# EAGLE design Motorboard (EAGLE 7.7.0)
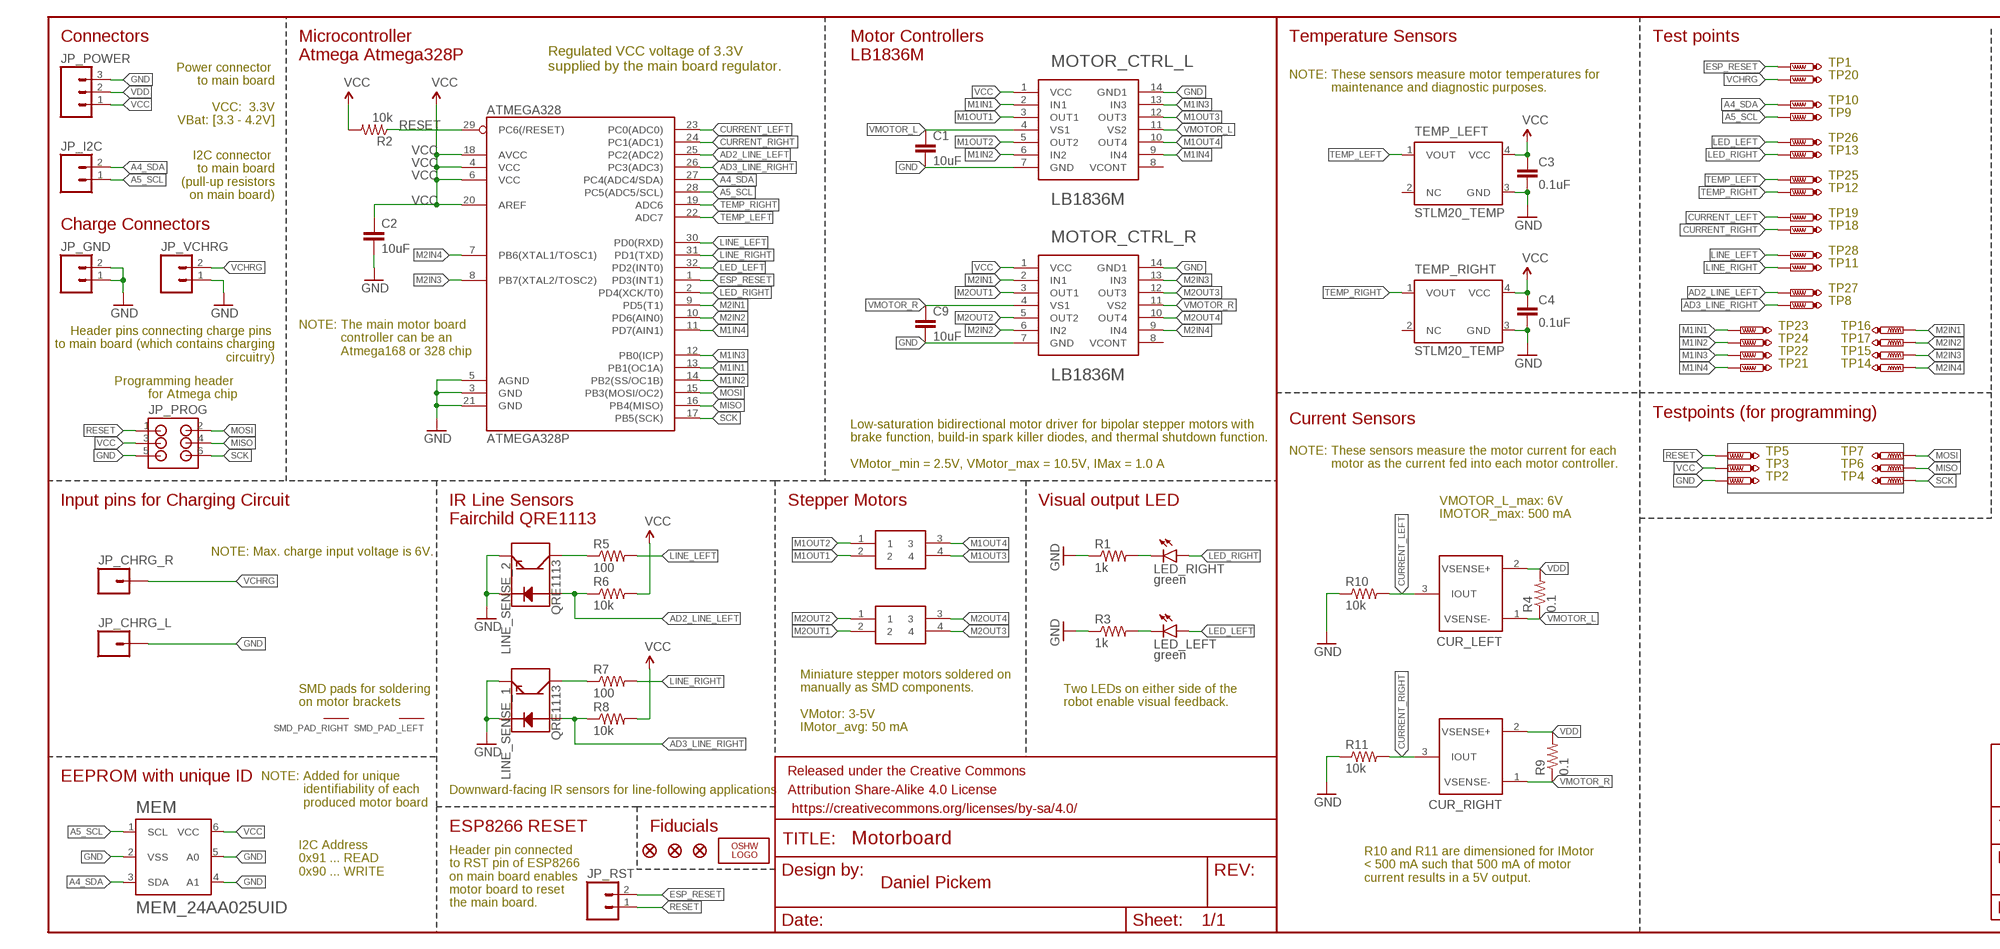
[diagram p0: schematic, sheet 1, part 1 of 2]
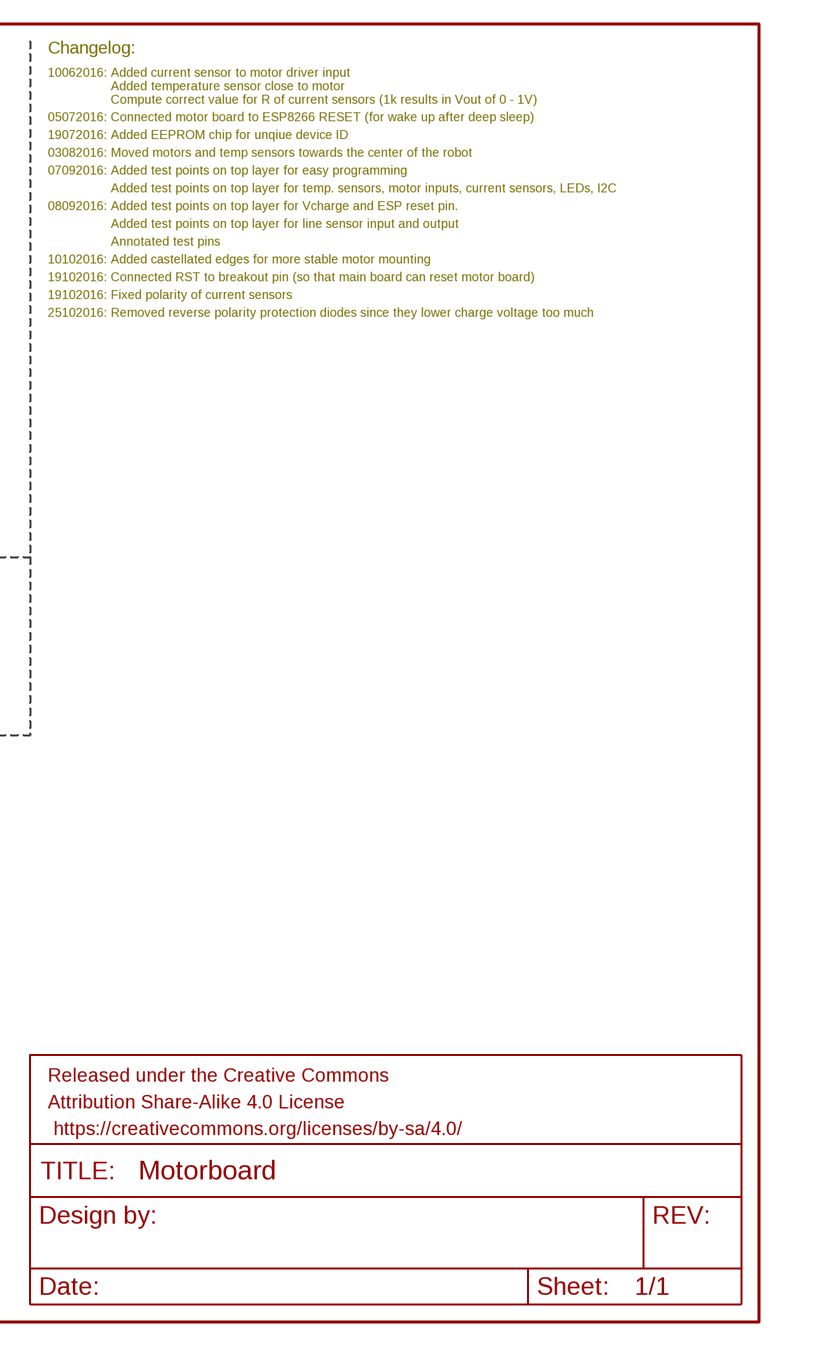
[diagram p1: schematic, sheet 1, part 2 of 2]

## Parts
ATMEGA328P  ATMEGA328  ATMEGA168  [TQFP32-08]
C1  10uF  2.2UF-25V-+80/-20(0805)  [0805]
C2  10uF  2.2UF-25V-+80/-20(0805)  [0805]
C3  0.1uF  4.7UF-6.3V-10%(0603)0603  [0603-CAP]
C4  0.1uF  4.7UF-6.3V-10%(0603)0603  [0603-CAP]
C9  10uF  2.2UF-25V-+80/-20(0805)  [0805]
CUR_LEFT  ZXCT1009_CURRENT  [SOT23-3]
CUR_RIGHT  ZXCT1009_CURRENT  [SOT23-3]
FRAME1  FRAME-LETTER  [CREATIVE_COMMONS]
FRAME2  FRAME-LETTER  [CREATIVE_COMMONS]
JP3  FIDUCIAL1X2.5  [FIDUCIAL-1X2.5]
JP4  FIDUCIAL1X2.5  [FIDUCIAL-1X2.5]
JP5  FIDUCIAL1X2.5  [FIDUCIAL-1X2.5]
JP_CHRG_L  M01NOSILK-KIT  [1X01NS-KIT]
JP_CHRG_R  M01NOSILK-KIT  [1X01NS-KIT]
JP_GND  M021X02_NO_SILK  [1X02_NO_SILK]
JP_I2C  M02PTH  [1X02]
JP_POWER  supply  M03PTH  [1X03]
JP_PROG  3X2_SMD_HEADER  [3X2_SMD_HEADER]
JP_RST  M021X02_NO_SILK  [1X02_NO_SILK]
JP_VCHRG  M021X02_NO_SILK  [1X02_NO_SILK]
LED_LEFT  green  LED0603  [LED-0603]
LED_RIGHT  green  LED0603  [LED-0603]
LINE_SENSE_1  QRE1113  [QRE1113]
LINE_SENSE_2  QRE1113  [QRE1113]
LOGO1  OSHW_LOGO_FILLX0100-NT  [OSHW_FILLX100_NOTEXT]
M1  STEPPER_MOTOR_SMD  [STEPPER_MOTOR_SMD]
M2  STEPPER_MOTOR_SMD  [STEPPER_MOTOR_SMD]
MEM  MEM_24AA025UID  [SOT23-6-MCP1640]
MOTOR_CTRL_L  LB1836M  [LSOP-14]
MOTOR_CTRL_R  LB1836M  [LSOP-14]
R1  1k  1.5KOHM1/10W1%(0603)  [0603]
R2  10k  1.5KOHM1/10W1%(0603)  [0603]
R3  1k  1.5KOHM1/10W1%(0603)  [0603]
R4  0.1  RESISTOR1206  [1206]
R5  100  1.5KOHM1/10W1%(0603)  [0603]
R6  10k  1.5KOHM1/10W1%(0603)  [0603]
R7  100  1.5KOHM1/10W1%(0603)  [0603]
R8  10k  1.5KOHM1/10W1%(0603)  [0603]
R9  0.1  RESISTOR1206  [1206]
R10  10k  1.5KOHM1/10W1%(0603)  [0603]
R11  10k  1.5KOHM1/10W1%(0603)  [0603]
SMD_PAD_LEFT  PIN_SMD2.5X1.0  [PIN_SMD_2.5X1.0]
SMD_PAD_RIGHT  PIN_SMD2.5X1.0  [PIN_SMD_2.5X1.0]
TEMP_LEFT  STLM20_TEMP  [UDFN4]
TEMP_RIGHT  STLM20_TEMP  [UDFN4]
TP1  PTR1B1,27  [B1,27]
TP2  PTR1B1,27  [B1,27]
TP3  PTR1B1,27  [B1,27]
TP4  PTR1B1,27  [B1,27]
TP5  PTR1B1,27  [B1,27]
TP6  PTR1B1,27  [B1,27]
TP7  PTR1B1,27  [B1,27]
TP8  PTR1B1,27  [B1,27]
TP9  PTR1B1,27  [B1,27]
TP10  PTR1B1,27  [B1,27]
TP11  PTR1B1,27  [B1,27]
TP12  PTR1B1,27  [B1,27]
TP13  PTR1B1,27  [B1,27]
TP14  PTR1B1,27  [B1,27]
TP15  PTR1B1,27  [B1,27]
TP16  PTR1B1,27  [B1,27]
TP17  PTR1B1,27  [B1,27]
TP18  PTR1B1,27  [B1,27]
TP19  PTR1B1,27  [B1,27]
TP20  PTR1B1,27  [B1,27]
TP21  PTR1B1,27  [B1,27]
TP22  PTR1B1,27  [B1,27]
TP23  PTR1B1,27  [B1,27]
TP24  PTR1B1,27  [B1,27]
TP25  PTR1B1,27  [B1,27]
TP26  PTR1B1,27  [B1,27]
TP27  PTR1B1,27  [B1,27]
TP28  PTR1B1,27  [B1,27]

## Nets
A4_SDA: ATMEGA328P.27(PC4(ADC4/SDA)) JP_I2C.2 MEM.3(SDA) TP10.TP
A5_SCL: ATMEGA328P.28(PC5(ADC5/SCL)) JP_I2C.1 MEM.1(SCL) TP9.TP
AD2_LINE_LEFT: ATMEGA328P.25(PC2(ADC2)) LINE_SENSE_2.1(A) R6.1 TP27.TP
AD3_LINE_RIGHT: ATMEGA328P.26(PC3(ADC3)) LINE_SENSE_1.1(A) R8.1 TP8.TP
CURRENT_LEFT: ATMEGA328P.23(PC0(ADC0)) CUR_LEFT.3(IOUT) R10.2 TP19.TP
CURRENT_RIGHT: ATMEGA328P.24(PC1(ADC1)) CUR_RIGHT.3(IOUT) R11.2 TP18.TP
ESP_RESET: ATMEGA328P.1(PD3(INT1)) JP_RST.2 TP1.TP
GND: ATMEGA328P.3(GND) ATMEGA328P.5(AGND) ATMEGA328P.21(GND) C1.2 C2.2 C3.2 C4.1 C9.2 JP_CHRG_L.1 JP_GND.1 JP_GND.2 JP_POWER.3 JP_PROG.5 JP_VCHRG.1 LINE_SENSE_1.2(K) LINE_SENSE_1.4(E) LINE_SENSE_2.2(K) LINE_SENSE_2.4(E) MEM.2(VSS) MEM.4(A1) MEM.5(A0) MOTOR_CTRL_L.7(GND) MOTOR_CTRL_L.14(GND1) MOTOR_CTRL_R.7(GND) MOTOR_CTRL_R.14(GND1) R1.1 R3.1 R10.1 R11.1 TEMP_LEFT.3(GND) TEMP_RIGHT.3(GND) TP2.TP
LED_LEFT: ATMEGA328P.32(PD2(INT0)) LED_LEFT.A TP26.TP
LED_RIGHT: ATMEGA328P.2(PD4(XCK/T0)) LED_RIGHT.A TP13.TP
LINE_LEFT: ATMEGA328P.30(PD0(RXD)) R5.2 TP28.TP
LINE_RIGHT: ATMEGA328P.31(PD1(TXD)) R7.2 TP11.TP
M1IN1: ATMEGA328P.13(PB1(OC1A)) MOTOR_CTRL_L.2(IN1) TP23.TP
M1IN2: ATMEGA328P.14(PB2(SS/OC1B)) MOTOR_CTRL_L.6(IN2) TP24.TP
M1IN3: ATMEGA328P.12(PB0(ICP)) MOTOR_CTRL_L.13(IN3) TP22.TP
M1IN4: ATMEGA328P.11(PD7(AIN1)) MOTOR_CTRL_L.9(IN4) TP21.TP
M1OUT1: M1.2 MOTOR_CTRL_L.3(OUT1)
M1OUT2: M1.1 MOTOR_CTRL_L.5(OUT2)
M1OUT3: M1.4 MOTOR_CTRL_L.12(OUT3)
M1OUT4: M1.3 MOTOR_CTRL_L.10(OUT4)
M2IN1: ATMEGA328P.9(PD5(T1)) MOTOR_CTRL_R.2(IN1) TP16.TP
M2IN2: ATMEGA328P.10(PD6(AIN0)) MOTOR_CTRL_R.6(IN2) TP17.TP
M2IN3: ATMEGA328P.8(PB7(XTAL2/TOSC2)) MOTOR_CTRL_R.13(IN3) TP15.TP
M2IN4: ATMEGA328P.7(PB6(XTAL1/TOSC1)) MOTOR_CTRL_R.9(IN4) TP14.TP
M2OUT1: M2.2 MOTOR_CTRL_R.3(OUT1)
M2OUT2: M2.1 MOTOR_CTRL_R.5(OUT2)
M2OUT3: M2.4 MOTOR_CTRL_R.12(OUT3)
M2OUT4: M2.3 MOTOR_CTRL_R.10(OUT4)
MISO: ATMEGA328P.16(PB4(MISO)) JP_PROG.4 TP6.TP
MOSI: ATMEGA328P.15(PB3(MOSI/OC2)) JP_PROG.2 TP7.TP
N$1: LED_LEFT.C R3.2
N$2: LINE_SENSE_2.3(C) R5.1
N$3: LINE_SENSE_1.3(C) R7.1
N$4: LED_RIGHT.C R1.2
RESET: ATMEGA328P.29(PC6(/RESET)) JP_PROG.1 JP_RST.1 R2.1 TP5.TP
SCK: ATMEGA328P.17(PB5(SCK)) JP_PROG.6 TP4.TP
TEMP_LEFT: ATMEGA328P.22(ADC7) TEMP_LEFT.1(VOUT) TP25.TP
TEMP_RIGHT: ATMEGA328P.19(ADC6) TEMP_RIGHT.1(VOUT) TP12.TP
VCC: ATMEGA328P.4(VCC) ATMEGA328P.6(VCC) ATMEGA328P.18(AVCC) ATMEGA328P.20(AREF) C2.1 C3.1 C4.2 JP_POWER.1 JP_PROG.3 MEM.6(VCC) MOTOR_CTRL_L.1(VCC) MOTOR_CTRL_R.1(VCC) R2.2 R6.2 R8.2 TEMP_LEFT.4(VCC) TEMP_RIGHT.4(VCC) TP3.TP
VCHRG: JP_CHRG_R.1 JP_VCHRG.2 TP20.TP
VDD: CUR_LEFT.2(VSENSE+) CUR_RIGHT.2(VSENSE+) JP_POWER.2 R4.2 R9.2
VMOTOR_L: C1.1 CUR_LEFT.1(VSENSE-) MOTOR_CTRL_L.4(VS1) MOTOR_CTRL_L.11(VS2) R4.1
VMOTOR_R: C9.1 CUR_RIGHT.1(VSENSE-) MOTOR_CTRL_R.4(VS1) MOTOR_CTRL_R.11(VS2) R9.1
Unconnected: MOTOR_CTRL_L.8(VCONT) MOTOR_CTRL_R.8(VCONT) SMD_PAD_LEFT.P$1 SMD_PAD_RIGHT.P$1 TEMP_LEFT.2(NC) TEMP_RIGHT.2(NC)

## Notes on the sheet
- Changelog:
- Connectors | Temperature Sensors | Test points
- 10062016: Added current sensor to motor driver input
                    Added temperature sensor close to motor
                    Compute correct value for R of current sensors (1k results in Vout of 0 - 1V)
- Microcontroller 
  Atmega Atmega328P
- Motor Controllers
  LB1836M
- Power connector 
  to main board
  
  VCC:  3.3V
  VBat: [3.3 - 4.2V]
- TP1
- Regulated VCC voltage of 3.3V 
  supplied by the main board regulator.
- TP20 | 05072016: Connected motor board to ESP8266 RESET (for wake up after deep sleep)
- NOTE: These sensors measure motor temperatures for 
              maintenance and diagnostic purposes.
- 19072016: Added EEPROM chip for unqiue device ID
- TP10 | 03082016: Moved motors and temp sensors towards the center of the robot
- TP9 | 07092016: Added test points on top layer for easy programming
- Added test points on top layer for temp. sensors, motor inputs, current sensors, LEDs, I2C
- TP26 | 08092016: Added test points on top layer for Vcharge and ESP reset pin.
- I2C connector 
  to main board
  (pull-up resistors
  on main board)
- TP13 | Added test points on top layer for line sensor input and output
- Annotated test pins
- TP25 | 10102016: Added castellated edges for more stable motor mounting
- TP12 | 19102016: Connected RST to breakout pin (so that main board can reset motor board)
- 19102016: Fixed polarity of current sensors
- TP19 | 25102016: Removed reverse polarity protection diodes since they lower charge voltage too much
- Charge Connectors | TP18
- TP28
- TP11
- TP27
- TP8
- Header pins connecting charge pins 
  to main board (which contains charging
  circuitry)
- TP23 | TP16
- TP24 | TP17
- NOTE: The main motor board
              controller can be an 
              Atmega168 or 328 chip
- TP22 | TP15
- TP21 | TP14
- Programming header 
  for Atmega chip
- Testpoints (for programming)
- Current Sensors
- TP5 | TP7
- Low-saturation bidirectional motor driver for bipolar stepper motors with
  brake function, build-in spark killer diodes, and thermal shutdown function.
  
  VMotor_min = 2.5V, VMotor_max = 10.5V, IMax = 1.0 A
- NOTE: These sensors measure the motor current for each
              motor as the current fed into each motor controller.
- TP3 | TP6
- TP2 | TP4
- Input pins for Charging Circuit | Stepper Motors | Visual output LED
- VMOTOR_L_max: 6V
  IMOTOR_max: 500 mA
- IR Line Sensors 
  Fairchild QRE1113
- NOTE: Max. charge input voltage is 6V.
- SMD pads for soldering
  on motor brackets
- Two LEDs on either side of the 
  robot enable visual feedback.
- Miniature stepper motors soldered on
  manually as SMD components.
  
  VMotor: 3-5V
  IMotor_avg: 50 mA
- EEPROM with unique ID
- Downward-facing IR sensors for line-following applications
- NOTE: Added for unique
              identifiability of each
              produced motor board
- ESP8266 RESET | Fiducials
- I2C Address
  0x91 ... READ
  0x90 ... WRITE
- R10 and R11 are dimensioned for IMotor 
  < 500 mA such that 500 mA of motor 
  current results in a 5V output.
- Daniel Pickem
- Header pin connected
  to RST pin of ESP8266
  on main board enables
  motor board to reset
  the main board.

## Library data of the parts
ATMEGA328P = GRITSBot:ATMEGA168: Atmel 32-pin 8-bit micro, 16k flash.
C1 C2 C9 = SparkFun-Capacitors:2.2UF-25V-+80/-20(0805): CAP-11624; PROD_ID: CAP-11624; VALUE: 2.2uF
C3 C4 = SparkFun-Capacitors:4.7UF-6.3V-10%(0603): CAP-08280; PROD_ID: CAP-08280; VALUE: 4.7uF
CUR_LEFT CUR_RIGHT = GRITSBot:ZXCT1009_CURRENT
FRAME1 FRAME2 = GRITSBot:FRAME-LETTER: Schematic Frame Standard 8.5x11 US Letter frame
JP3-JP5 = abes:FIDUCIAL: Fiducial Alignment Points Various fiducial points for machine vision alignment.
JP_CHRG_L JP_CHRG_R = SparkFun-Connectors:M01: Header 1 Standard 1-pin 0.1" header. Use with straight break away headers (SKU : PRT-00116), right angle break away headers (PRT-00553), swiss pins (PRT-00743), machine pins (PRT-00117), and female headers (PRT-00115). SMTSO-256-ET is a "flush mount" nut for a 4-40 screw. The older package used to be too tight, and did not allow it to sit properly thru the drill hit. The latest (0.165DIA) fits nice and snug.
JP_GND JP_I2C JP_RST JP_VCHRG = SparkFun-Connectors:M02: Standard 2-pin 0.1" header. Use with - straight break away headers ( PRT-00116) - right angle break away headers (PRT-00553) - swiss pins (PRT-00743) - machine pins (PRT-00117) - female headers (PRT-00115) Molex polarized connector foot print use with: PRT-08233 with associated crimp pins and housings. 2.54_SCREWTERM for use with PRT-10571. 3.5mm Screw Terminal footprints for PRT-08084 5mm Screw Terminal footprints for use with PRT-08433
JP_POWER = SparkFun-Connectors:M03: Header 3 Standard 3-pin 0.1" header. Use with straight break away headers (SKU : PRT-00116), right angle break away headers (PRT-00553), swiss pins (PRT-00743), machine pins (PRT-00117), and female headers (PRT-00115). Molex polarized connector foot print use with SKU : PRT-08232 with associated crimp pins and housings.
JP_PROG = GRITSBot:3X2_SMD_HEADER
LED_LEFT LED_RIGHT = SparkFun-LED:LED: LEDs Standard schematic elements and footprints for 5mm, 3mm, 1206, and 0603 sized LEDs. 5mm - Spark Fun Electronics SKU : COM-00529 (and others)
LINE_SENSE_1 LINE_SENSE_2 = SparkFun-Sensors:QRE1113: Reflective object sensor; PROD_ID: IC-09357
LOGO1 = OSHW:OSHW_LOGO_FILL
M1 M2 = GRITSBot:STEPPER_MOTOR_SMD
MEM = GRITSBot:MEM_24AA025UID
MOTOR_CTRL_L MOTOR_CTRL_R = GRITSBot:LB1836M: LB1836M: Low-Saturation Bidirectional Motor Driver for Low-Voltage Drive • Low voltage operation (2.5V min) • Low saturation voltage (upper transistor + lower transistor residual voltage ; 0.40V typ at 400mA). • Parallel connection (Upper transistor + lower tr ansistor residual voltage ; 0.5V typ at 800mA). • Separate logic power supply and motor power supply • Brake function • Spark killer diodes built in • Thermal shutdown circuit built in • Compact package (14-pin MFP) (see http://www.onsemi.com/pub_link/Collateral/LB1836M-D.PDF)
R1-R3 R5-R8 R10 R11 = SparkFun-Resistors:1.5KOHM1/10W1%(0603): RES-08306; PROD_ID: RES-08306; VALUE: 1.5KOHM
R4 R9 = SparkFun-Resistors:RESISTOR: Resistor Basic schematic elements and footprints for 0603, 1206, and PTH resistors.
SMD_PAD_LEFT SMD_PAD_RIGHT = GRITSBot:PIN_SMD
TEMP_LEFT TEMP_RIGHT = GRITSBot:STLM20_TEMP
TP1-TP28 = testpad:PTR1: TEST PIN

## Net classes
1 power: width 0.381 mm, clearance 0.254 mm

## Board
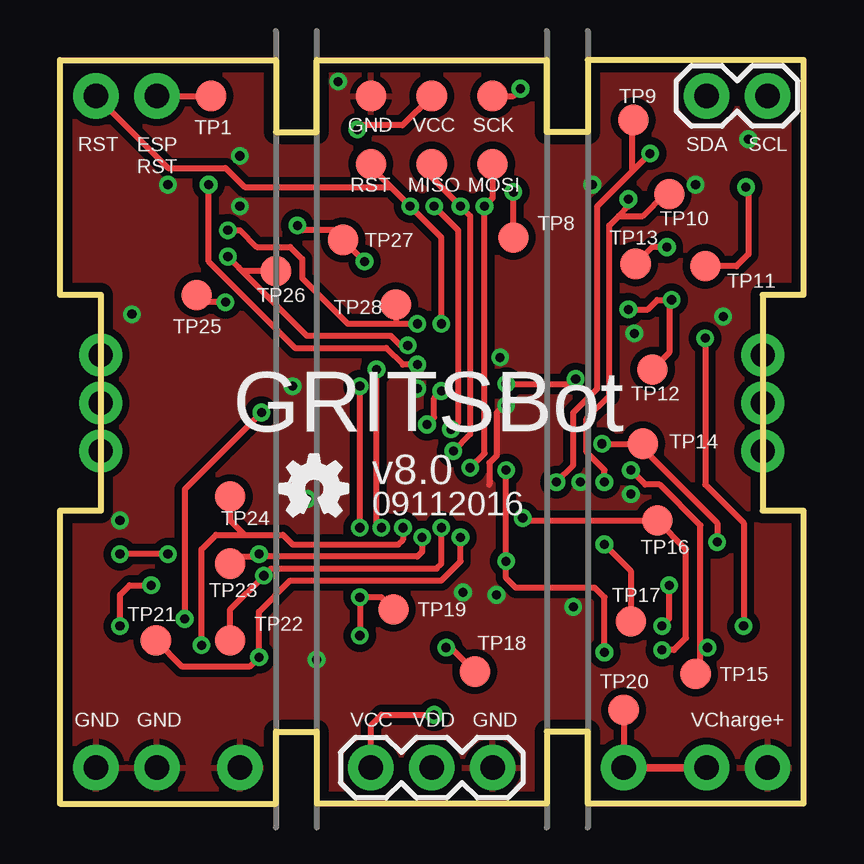
[diagram p2: board, top side]
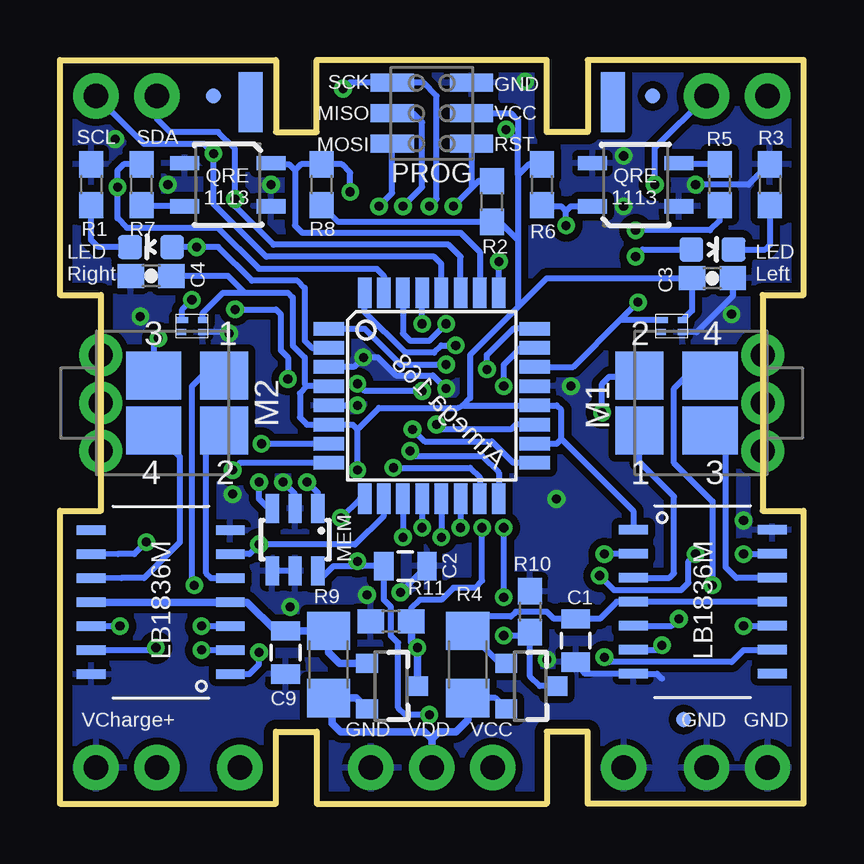
[diagram p3: board, bottom side, seen from below]

Size 31 x 31 mm. Coordinates in mm from the lower left corner, seen from the top.
Outline: 0,0 0,12.2 1.7,12.2 1.7,21.2 0,21.2 0,31 9,31 9,28 10.7,28 10.7,31 20.3,31 20.3,28 22,28 22,31 31,31 31,21.2 29.3,21.2 29.3,12.2 31,12.2 31,0 22,0 22,3 20.3,3 20.3,0 10.7,0 10.7,3 9,3 9,0 0,0
Copper layers (1*16): Top 0.0356mm / dielectric 1.5011mm / Bottom 0.0356mm
Design rules "default": minimum track width 6mil, minimum drill 13mil, track to track 6mil, track to pad 6mil, pad to pad 6mil, via to via 6mil, smd to smd 6mil, copper to edge 15mil, drill to drill 6mil, minimum pad ring 7mil, minimum via ring 7mil, stop-mask expansion 3mil, vias tented up to drill 40mil, thermal gap 10mil

### Footprints (pad centres in the part's own frame; a part is rotated, then mirrored left to right if it is on the bottom)
TQFP32-08 = smd 1.27 x 0.559: 1 -4.293,2.8; 2 -4.293,2; 3 -4.293,1.2; 4 -4.293,0.4; 5 -4.293,-0.4; 6 -4.293,-1.2; 7 -4.293,-2; 8 -4.293,-2.8; 17 4.293,-2.8; 18 4.293,-2; 19 4.293,-1.2; 20 4.293,-0.4; 21 4.293,0.4; 22 4.293,1.2; 23 4.293,2; 24 4.293,2.8 | smd 0.559 x 1.27: 9 -2.8,-4.293; 10 -2,-4.293; 11 -1.2,-4.293; 12 -0.4,-4.293; 13 0.4,-4.293; 14 1.2,-4.293; 15 2,-4.293; 16 2.8,-4.293; 25 2.8,4.293; 26 2,4.293; 27 1.2,4.293; 28 0.4,4.293; 29 -0.4,4.293; 30 -1.2,4.293; 31 -2,4.293; 32 -2.8,4.293
0805 = smd 0.8 x 1.2: 1 -0.9,0; 2 0.9,0
0603-CAP = smd 1.1 x 1: 1 -0.85,0; 2 0.85,0
SOT23-3 = smd 0.8 x 0.9: 1 -0.95,-1; 2 0.95,-1; 3 0,1.1
FIDUCIAL-1X2.5 = smd 0.635 x 0.635: 1 0,0
1X01NS-KIT = drill 1.016 pad 1.88: 1 0,0
1X02_NO_SILK = drill 1.016 pad 1.88: 1 0,0; 2 2.54,0
1X02 = drill 1.016 pad 1.88: 1 0,0; 2 2.54,0
1X03 = drill 1.016 pad 1.88: 1 0,0; 2 2.54,0; 3 5.08,0
3X2_SMD_HEADER = smd 1.8 x 0.76: 1 -1.65,1.29; 2 1.65,1.29; 3 -1.65,0.02; 4 1.65,0.02; 5 -1.65,-1.25; 6 1.65,-1.25
LED-0603 = smd 1 x 1: A 0,-0.877; C 0,0.877
QRE1113 = smd 1.2 x 0.6: 1 -1.8,-0.9; 2 1.8,-0.9; 3 1.8,0.9; 4 -1.8,0.9
STEPPER_MOTOR_SMD = smd 2 x 2: 1 -1.55,1.15; 2 -1.55,-1.15 | smd 2.3 x 2: 3 1.4,1.15; 4 1.4,-1.15
SOT23-6-MCP1640 = smd 0.55 x 1.2: 1 -0.95,-1.3; 2 0,-1.3; 3 0.95,-1.3; 4 0.95,1.3; 5 0,1.3; 6 -0.95,1.3
LSOP-14 = smd 0.4 x 1.2: 1 -3.01,-2.9; 2 -2.01,-2.9; 3 -1.01,-2.9; 4 -0.01,-2.9; 5 0.99,-2.9; 6 1.99,-2.9; 7 2.99,-2.9; 8 2.99,2.9; 9 1.99,2.9; 10 0.99,2.9; 11 -0.01,2.9; 12 -1.01,2.9; 13 -2.01,2.9; 14 -3.01,2.9
0603 = smd 1.1 x 1: 1 -0.85,0; 2 0.85,0
1206 = smd 1.6 x 1.8: 1 -1.4,0; 2 1.4,0
PIN_SMD_2.5X1.0 = smd 2.5 x 1: P$1 0,0
UDFN4 = smd 0.5 x 0.25: 1 -0.4,0.25 | smd 0.4 x 0.25: 2 -0.45,-0.25; 3 0.45,-0.25; 4 0.45,0.25
B1,27 = smd 1.27 x 1.27: TP 0,0

### Placement (x,y rotation side)
ATMEGA328P  15.5,17 0 bottom
C1  9.5,6.8 270 bottom
C2  16.6,9.9 0 bottom
C3  3.8,21.9 0 bottom
C4  27.2,22 0 bottom
C9  21.6,6.3 270 bottom
CUR_LEFT  11.4,4.9 270 bottom
CUR_RIGHT  17.2,4.9 270 bottom
FRAME1  0,0 0 top
FRAME2  0,0 0 top
FRAME3  FRAME-LETTER  [CREATIVE_COMMONS]  0,0 0 top
JP3  24.6,29.5 0 bottom
JP4  6.3,29.5 0 bottom
JP5  5,3.5 0 bottom
JP_CHRG_L  7.5,1.5 0 top
JP_CHRG_R  23.5,1.5 0 top
JP_GND  1.5,1.5 0 top
JP_I2C  29.5,29.5 180 top
JP_POWER  12.96,1.5 0 top
JP_PROG  15.5,28.8 180 bottom
JP_RST  1.5,29.5 0 top
JP_VCHRG  29.5,1.5 180 top
LED_LEFT  3.8,23.1 270 bottom
LED_RIGHT  27.2,23.2 90 bottom
LINE_SENSE_1  24,25.8 180 bottom
LINE_SENSE_2  7,25.8 0 bottom
LOGO1  9.18,12 0 top
M1  5.3,16.7 0 bottom
M2  25.7,16.7 180 bottom
MEM  21.2,11 180 bottom
MOTOR_CTRL_L  4.2,8.4 270 bottom
MOTOR_CTRL_R  26.8,8.4 90 bottom
R1  29.7,25.8 270 bottom
R2  13,25.1 270 bottom
R3  1.4,25.8 270 bottom
R4  14,5.8 270 bottom
R5  3.5,25.8 270 bottom
R6  10.9,25.8 90 bottom
R7  27.6,25.8 90 bottom
R8  20.1,25.8 270 bottom
R9  19.8,5.8 270 bottom
R10  11.4,8 270 bottom
R11  17.2,7.6 0 bottom
SMD_PAD_LEFT  7.95,29.24 90 bottom
SMD_PAD_RIGHT  23.05,29.24 90 bottom
TEMP_LEFT  5.5,19.9 0 bottom
TEMP_RIGHT  25.5,19.9 0 bottom
TP1  6.3,29.5 0 top
TP2  12.96,29.5 0 top
TP3  15.5,29.5 0 top
TP4  18.04,29.5 0 top
TP5  12.96,26.66 0 top
TP6  15.5,26.66 0 top
TP7  18.04,26.66 0 top
TP8  18.9,23.6 90 top
TP9  23.9,28.5 0 top
TP10  25.4,25.4 0 top
TP11  26.9,22.4 90 top
TP12  24.7,18.1 0 top
TP13  24,22.5 0 top
TP14  24.3,15 0 top
TP15  26.5,5.4 0 top
TP16  24.9,11.8 0 top
TP17  23.8,7.6 0 top
TP18  17.3,5.5 0 top
TP19  13.9,8.1 0 top
TP20  23.5,3.9 0 top
TP21  4,6.8 0 top
TP22  7.1,6.8 0 top
TP23  7.1,10 0 top
TP24  7.1,12.8 0 top
TP25  5.7,21.2 0 top
TP26  9,22.2 0 top
TP27  11.8,23.5 90 top
TP28  14,20.8 90 top

### Tracks (layer width: path | path; a pad name or v marks a point on that pad's centre or on a via)
A4_SDA  (via drill 0.38)
  Top 0.254: v23.7,25.2 23.7,24.9 23.3,24.5 | 23.3,24.5 22.9,24.1 22.9,17 21.95,16.05 21.95,14.65 22.7,13.9 v22.7,13.4 | 23.3,24.5 24.3,24.5 25.2,25.4 TP10.TP
  Bottom 0.254: ATMEGA328P.27 14.3,22.8 14.8,23.3 22.1,23.3 23.7,24.9 v23.7,25.2 23.7,27.3 24.4,28 26.4,28 26.96,28.56 JP_I2C.2 | MEM.3 22.3,12.3 22.7,12.7 v22.7,13.4
A5_SCL  (via drill 0.38)
  Top 0.254: v20.7,13.4 21.4,14.1 21.4,16.3 22.4,17.3 22.4,24.9 23.85,26.35 | 23.85,26.35 v24.6,27.1 | TP9.TP 23.85,28.45 23.85,26.35
  Bottom 0.254: ATMEGA328P.28 15.1,22.5 15.4,22.8 22.4,22.8 24.6,25 v24.6,27.1 25,27.5 27.5,27.5 JP_I2C.1 | MEM.1 20.25,12.95 v20.7,13.4
AD2_LINE_LEFT  (via drill 0.38)
  Top 0.254: v9.9,24.1 10.1,23.9 11.4,23.9 TP27.TP v12.7,22.6
  Bottom 0.254: 10.9,24.9 R6.1 10.85,24.9 10.1,24.9 9.9,24.7 | ATMEGA328P.25 v12.7,22.6 | v9.9,24.1 9.9,24.7 | 9.9,24.7 9.7,24.9 LINE_SENSE_2.1
AD3_LINE_RIGHT  (via drill 0.38)
  Top 0.254: TP8.TP v18.9,25.5
  Bottom 0.254: LINE_SENSE_1.1 22.15,26.65 21.45,26.65 21.2,26.4 | 21.2,26.4 21.2,24.1 20.9,23.8 14.3,23.8 13.5,23 ATMEGA328P.26 | 21.2,26.4 20.95,26.65 R8.1 19.25,26.65 18.9,26.3 v18.9,25.5
CURRENT_LEFT  (via drill 0.38)
  Top 0.254: v12.5,11.5 v12.5,17.4 | TP19.TP 13.4,8.6 v12.5,8.6 v12.5,7
  Bottom 0.254: v12.5,17.4 12.5,18.3 11.8,19 ATMEGA328P.23 | CUR_LEFT.3 11,4.9 11.4,5.3 R10.2 11.55,7 v12.5,7 | v12.5,8.6 v12.5,11.5
CURRENT_RIGHT  (via drill 0.38)
  Top 0.254: v13.4,11.5 13.2,11.7 v13.2,18.1 | TP18.TP 16.3,6.5 v16.1,6.5
  Bottom 0.254: R11.2 16.35,8.15 16,8.5 15.1,8.5 14.6,9 13.7,9 13.4,9.3 v13.4,11.5 | ATMEGA328P.24 12.1,19.8 13.2,18.7 v13.2,18.1
  Bottom 0.305: R11.2 16.35,6.75 v16.1,6.5 CUR_RIGHT.3
ESP_RESET  (via drill 0.38)
  Top 0.254: v14.9,18.3 14.3,18.3 13.6,19 9.8,19 6.2,22.6 v6.2,25.8 | JP_RST.2 TP1.TP
  Bottom 0.254: ATMEGA328P.1 18.3,19.8 16.8,18.3 v14.9,18.3 | v6.2,25.8 6.2,27.34 JP_RST.2
GND  (via drill 0.38)
  Top 0.254: v18.6,16.6 18.5,16.6 18.2,16.3 18.2,14.5 17.9,14.2 17.9,13.3
  Bottom 0.254: MOTOR_CTRL_L.7 6.11,5.41 5.9,5.2 | R11.1 18.05,7.95 | C2.2 v16.8,8.8 | MEM.5 MEM.4 | R3.1 1.45,26.65 2.3,25.8 v4.5,25.8 | v14.9,17.3 15.45,17.85 17,17.85 17.75,18.6 v18.35,18.6 18.75,18.2 ATMEGA328P.3 | ATMEGA328P.5 v18.6,16.6 | MEM.2 21.2,12.9 v21.7,13.4 | MOTOR_CTRL_L.7 | C3.2 2.95,21.15 4.45,19.65 TEMP_LEFT.3 | v23.95,19.6 24,19.65 TEMP_RIGHT.3 | MOTOR_CTRL_L.7 9.11,5.41 C1.2
  other vias: 28.7,27.7 9.7,17.4 26.5,25.8 22.2,25.8 7.5,24.9 11.6,30.1 2.5,11.8 3,20.4 27.65,20.3 18.2,8.7 23.8,12.9 21.4,8.2 7.5,27 10.7,6 10.3,12.7
  pour Bottom (isolate 0.305): 0,31 0,21.2 1.7,21.2 1.7,12.2 0,12.2 0,0 31,0 31,12.2 29.3,12.2 29.3,21.2 31,21.2 31,31
  pour Top (isolate 0.305): 0,31 0,21.2 1.7,21.2 1.7,12.2 0,12.2 0,0 31,0 31,12.2 29.3,12.2 29.3,21.2 31,21.2 31,31
LED_LEFT  (via drill 0.38)
  Top 0.254: v14.5,19.1 14.2,19.1 13.8,19.5 10.3,19.5 7.6,22.2 | v7,22.8 7.45,22.35 7.6,22.2 | TP26.TP 7.6,22.2
  Bottom 0.254: v7,22.8 6.7,23.1 LED_LEFT.A | v14.5,19.1 15.1,19.1 15.4,18.8 16.6,18.8 18.3,20.5 ATMEGA328P.32
LED_RIGHT  (via drill 0.38)
  Top 0.254: v25.3,23.2 24.7,23.2 TP13.TP
  Bottom 0.254: ATMEGA328P.2 20.5,19 20.8,19.3 20.8,21.5 21.1,21.8 23,21.8 24.4,23.2 v25.3,23.2 LED_RIGHT.A
LINE_LEFT  (via drill 0.38)
  Top 0.254: v14.9,20 14,20 | 14,20 12,20 10.1,21.9 10.1,22.7 9.6,23.2 8.2,23.2 7.5,23.9 v7,23.9 7.1,23.9 | TP28.TP 14,20
  Bottom 0.254: v7,23.9 3.9,23.9 3.5,24.3 R5.2 | ATMEGA328P.30 16.7,19.6 16.4,19.3 15.6,19.3 v14.9,20
LINE_RIGHT  (via drill 0.38)
  Top 0.254: v28.6,25.7 28.7,25.6 28.7,22.9 28.2,22.4 TP11.TP
  Bottom 0.254: ATMEGA328P.31 17.5,22 17.8,22.3 22.7,22.3 24.4,24 28.2,24 28.6,24.4 v28.6,25.7 28.6,26.4 28.35,26.65 R7.2
M1IN1  (via drill 0.38)
  Top 0.254: v15.1,11.1 15.1,10.5 14.9,10.3 8.4,10.3 | 8.4,10.3 v8.3,10.4 | TP23.TP 7.4,10.3 8.4,10.3
  Bottom 0.254: ATMEGA328P.13 v15.1,11.1 | v8.3,10.4 7.99,10.41 MOTOR_CTRL_L.2
M1IN2  (via drill 0.38)
  Top 0.254: v14.3,11.5 14.3,11 14.1,10.8 9.7,10.8 9.3,11.2 7.7,11.2 | 7.55,12.95 TP24.TP 7.5,12.9 7.1,12.5 7.1,11.8 7.7,11.2 | v5.9,6.6 5.9,10.6 6.5,11.2 7.7,11.2
  Bottom 0.254: ATMEGA328P.14 v14.3,11.5 | MOTOR_CTRL_L.6 6.09,6.41 v5.9,6.6
M1IN3  (via drill 0.38)
  Top 0.254: v4.5,10.4 v2.5,10.4 | v15.9,11.5 15.9,10 15.7,9.8 8.8,9.8 v8.5,9.5 7.1,8.1 TP22.TP
  Bottom 0.254: v4.5,10.4 4.8,10.1 4.8,9.2 5.1,8.9 7.9,8.9 v8.5,9.5 | ATMEGA328P.12 v15.9,11.5 | v2.5,10.4 MOTOR_CTRL_L.13
M1IN4  (via drill 0.38)
  Top 0.254: v16.7,11.1 16.7,10.1 15.9,9.3 9.6,9.3 8.3,8 v8.3,6.1 7.9,5.7 5.1,5.7 TP21.TP 3.6,6.5
  Bottom 0.254: ATMEGA328P.11 v16.7,11.1 | MOTOR_CTRL_L.9 2.5,6.4 3,5.9 8.1,5.9 v8.3,6.1
M1OUT1
  Bottom 0.254: MOTOR_CTRL_L.3 5.59,9.41 5.4,9.6 5.4,12.8 6.85,14.25 M1.2
M1OUT2  (via drill 0.38)
  Top 0.254: v5.2,7.7 5.2,13.1 v8.4,16.3
  Bottom 0.254: MOTOR_CTRL_L.5 5.49,7.41 v5.2,7.7 | v8.4,16.3 8.4,17.5 8.1,17.8 6.9,17.8 M1.1
M1OUT3
  Bottom 0.254: 4.35,16.1 M1.4 3.25,14.9 3.25,9.85 2.8,9.4 MOTOR_CTRL_L.12
M1OUT4  (via drill 0.38)
  Top 0.254: v2.5,7.4 2.5,8.7 2.9,9.1 v3.8,9.1
  Bottom 0.254: v2.5,7.4 MOTOR_CTRL_L.10 | v3.8,9.1 3.8,12.6 5.4,14.2 5.4,17.3 4.9,17.8 3.95,17.8 M1.3
M2IN1  (via drill 0.38)
  Top 0.254: v25.1,6.4 25.6,6.4 26.1,6.9 26.1,10.6 TP16.TP 25.41,11.8 25.4,11.81 19.39,11.81 v19.29,11.91
  Bottom 0.254: v25.1,6.4 MOTOR_CTRL_R.2 | ATMEGA328P.9 18.5,12.7 v19.29,11.91
M2IN2  (via drill 0.38 pad 0.25)
  Top 0.254: v22.7,10.8 23.8,9.7 TP17.TP
  Bottom 0.254: ATMEGA328P.10 17.5,12 18.7,10.8 v22.7,10.8 23.1,10.4 MOTOR_CTRL_R.6
M2IN3  (via drill 0.38)
  Top 0.254: 26.7,6.8 26.7,11.6 25,13.3 24.4,13.3 v23.8,13.9 | 26.7,6.8 v27,6.5 | TP15.TP 26.7,5.6 26.7,6.8
  Bottom 0.254: ATMEGA328P.8 23.5,14.2 v23.8,13.9 | v27,6.5 27.11,6.39 MOTOR_CTRL_R.13
M2IN4  (via drill 0.38)
  Top 0.254: v27.4,10.9 27.4,11.7 24.3,14.8 TP14.TP v22.6,15
  Bottom 0.254: ATMEGA328P.7 v22.6,15 | v27.4,10.9 27.9,10.4 28.59,10.4 MOTOR_CTRL_R.9
M2OUT1  (via drill 0.38)
  Top 0.254: v25.1,7.4 25.4,7.7 v25.4,9.1
  Bottom 0.254: v25.1,7.4 MOTOR_CTRL_R.3 | v25.4,9.1 25.5,9.2 25.5,17.4 25.1,17.8 24.2,17.8 M2.2
M2OUT2
  Bottom 0.254: MOTOR_CTRL_R.5 24.7,9.4 24.9,9.6 24.9,14.8 M2.1
M2OUT3  (via drill 0.38)
  Top 0.254: v26.9,19.4 26.9,13.3 28.5,11.7 v28.5,7.4
  Bottom 0.254: 27.15,18.3 M2.4 | v28.5,7.4 28.71,7.39 MOTOR_CTRL_R.12 | 27.15,17.8 M2.4 | v26.9,19.4 27.1,19.2 M2.4
M2OUT4
  Bottom 0.254: MOTOR_CTRL_R.10 28.44,9.4 27.5,9.4 26,10.9 26,14.45 M2.3
MISO  (via drill 0.38)
  Top 0.254: v16.4,14.7 17.1,15.4 17.1,24.5 v16.7,24.9 15.5,26.1 TP6.TP 15.9,26.56
  Bottom 0.254: ATMEGA328P.16 12.7,13.8 13.4,14.5 16.2,14.5 v16.4,14.7 | JP_PROG.4 16.28,28.78 15.9,28.4 15.9,25.7 v16.7,24.9
MOSI  (via drill 0.38)
  Top 0.254: v17.1,14 17.7,14.6 v17.7,24.9 18.04,25.24 TP7.TP
  Bottom 0.254: v17.1,14 13.9,14 13.5,13.6 ATMEGA328P.15 | JP_PROG.2 17.15,25.45 v17.7,24.9
N$1
  Bottom 0.254: R3.2 1.4,23.3 1.6,23.1 LED_LEFT.C
N$2
  Bottom 0.254: R5.1 5.2,26.65 LINE_SENSE_2.3
N$3
  Bottom 0.254: LINE_SENSE_1.3 27.55,24.9 R7.1
N$4
  Bottom 0.254: LED_RIGHT.C 29.4,23.2 29.7,23.5 R1.2
N$7  (via drill 1 pad 1.78)
  other vias: 29.3,16.7
N$8  (via drill 1 pad 1.78)
  other vias: 29.3,14.7
N$9  (via drill 1 pad 1.78)
  other vias: 29.3,18.7
N$11  (via drill 1 pad 1.78)
  other vias: 1.7,16.7
N$12  (via drill 1 pad 1.78)
  other vias: 1.7,14.7
N$13  (via drill 1 pad 1.78)
  other vias: 1.7,18.7
RESET  (via drill 0.38)
  Top 0.254: v15.9,20 15.9,23.6 v14.6,24.9 13.8,25.7 | TP5.TP 12.96,26.54 13.8,25.7 | JP_RST.1 4.5,26.5 6.9,26.5 7.7,25.7 13.8,25.7
  Bottom 0.254: v15.9,20 ATMEGA328P.29 | 13.85,25.65 13.55,25.95 R2.1 | JP_PROG.1 13.85,25.65 | v14.6,24.9 13.85,25.65
SCK  (via drill 0.38, 0.38 pad 0.25)
  Top 0.254: v16.3,15.6 16.6,15.9 16.6,23.9 v15.6,24.9 | TP4.TP 18.9,29.5 v19.2,29.8
  Bottom 0.254: ATMEGA328P.17 12.1,14.2 13,15.1 15.8,15.1 v16.3,15.6 | v15.6,24.9 15.3,25.2 15.3,29.5 15.85,30.05 JP_PROG.6 18.95,30.05 v19.2,29.8
TEMP_LEFT  (via drill 0.38)
  Top 0.254: v6.9,20.9 6,20.9 TP25.TP
  Bottom 0.254: ATMEGA328P.22 9.6,18.2 7.65,20.15 | TEMP_LEFT.1 7.65,20.15 | v6.9,20.9 7.65,20.15
TEMP_RIGHT  (via drill 0.38)
  Top 0.254: v18.6,17.5 21.3,17.5 v21.5,17.7 | v15.3,15.8 15.6,16.1 15.6,16.9 v15.9,17.2 | 24.6,18.1 TP12.TP 25.4,18.8 25.4,20.9 v25.5,21 24.9,21 24.5,20.6 v23.7,20.6
  Bottom 0.254: v23.7,20.6 22,20.6 21.8,20.4 21.8,18.9 21.5,18.6 v21.5,17.7 | 15.2,15.7 v15.3,15.8 15.1,15.6 12.2,15.6 12,15.8 ATMEGA328P.19 | v15.9,17.2 18.3,17.2 v18.6,17.5 | TEMP_RIGHT.1 25.9,20.6 v25.5,21
VCC  (via drill 0.38, 0.38 pad 0.25)
  Top 0.254: v18.6,13.9 v18.6,10.1 18.6,9.4 19,9 22.3,9 22.7,8.6 v22.7,6.3 | TP3.TP 14.28,28.28 12.58,28.28 v12.4,28.1 | JP_POWER.1 12.96,3.26 13.4,3.7 v15.6,3.7
  Bottom 0.152: C4.2 26.15,21.75
  Bottom 0.254: 14.2,16.6 ATMEGA328P.20 10.3,16.6 10.1,16.4 10.1,15.2 | 14.2,16.6 13.9,16.9 13.9,18.7 11.9,20.7 | ATMEGA328P.4 20.7,17.4 | 20.7,17.4 21,17.1 21,16.1 20.7,15.8 ATMEGA328P.6 18.8,15.8 18.6,15.6 | v18.6,13.9 18.6,15.6 | JP_PROG.3 12.18,28.78 11.9,28.5 11.9,27.6 | 11.9,26.2 11.9,23.5 | 11.9,23.5 12.65,24.25 R2.2 19.4,24.25 R8.2 | R6.2 11.45,26.65 11.9,26.2 | 11.9,23.5 11.9,20.7 | 23.3,21.3 21.5,21.3 21.3,21.1 21.3,19.1 20.8,18.6 20.8,17.5 20.7,17.4 | MOTOR_CTRL_L.1 7.1,12.2 10.1,15.2 | MOTOR_CTRL_R.1 23.1,5.4 22.7,5.8 v22.7,6.3 | 10.1,15.2 10.3,15 ATMEGA328P.18 | 11.9,20.7 10.7,21.9 C3.1 4.65,20.55 TEMP_LEFT.4 | 23.3,21.3 24,22 C4.2 | 18.4,9.9 C2.1 17.5,8.5 17.2,8.2 17.2,7 16.9,6.7 16.9,4 16.6,3.7 v15.6,3.7 | 18.4,9.9 v18.6,10.1 | MEM.6 20,9.5 19.6,9.9 18.4,9.9 | 14.2,16.6 14.4,16.5 17.7,16.5 18.6,15.6 | TEMP_RIGHT.4 25.05,20.45 24.2,21.3 23.3,21.3 | 11.9,26.2 11.9,27.6 | 11.9,27.6 v12.4,28.1
VCHRG
  Top 0.254: TP20.TP JP_CHRG_R.1
  Top 0.305: JP_CHRG_R.1 JP_VCHRG.2
VDD
  Bottom 0.254: CUR_LEFT.2 12.85,4.4 R4.2
  Bottom 0.305: 15.5,2.7 15.8,3 19.3,3 19.65,3.35 19.65,4.25 R9.2 18.65,4.4 CUR_RIGHT.2 | 15.5,2.7 JP_POWER.2 | 15.5,2.7 15.2,3 14.5,3 14,3.5 R4.2
VMOTOR_L
  Bottom 0.254: MOTOR_CTRL_L.11 MOTOR_CTRL_L.4 7.79,8.41 8.5,7.7 C1.1 10.4,7.7 10.7,8 12,8 12.2,7.8 13.4,7.8 R4.1 12.65,5.85
  Bottom 0.305: CUR_LEFT.1 12.65,5.85
VMOTOR_R
  Bottom 0.305: MOTOR_CTRL_R.11 MOTOR_CTRL_R.4 23.19,8.39 22,7.2 C9.1 R9.1 19.8,6.3 19.35,5.85 CUR_RIGHT.1

### Text on the board
tPlace: TP9 | ESP / RST | TP1 | GND | VCC | SCK | RST | SDA | SCL | RST | MISO | MOSI | TP8 | TP10 | TP27 | TP13 | TP11 | TP26 | TP25 | TP28 | TP12 | GRITSBot | TP14 | v8.0 | TP24 | 09112016 | TP16 | TP23 | TP21 | TP19 | TP17 | TP22 | TP18 | TP20 | TP15 | GND | GND | VCC | VDD | GND | VCharge+
bPlace: GND | SCK | MISO | VCC | MOSI | SDA | SCL | RST | QRE / 1113 | PROG | QRE / 1113 | LED / Left | LED / Right | 4 | 2 | 1 | 3 | M1 | M2 | Atmega 168 | 3 | 1 | 2 | 4 | GND | GND | VCC | VDD | GND | VCharge+
tDocu: Released under the Creative Commons Attribution Share-Alike 4.0 License / https://creativecommons.org/licenses/by-sa/4.0/ | Designed by: Daniel Pickem (http://www.danielpickem.com/) at the / GRITSLab at Georgia Tech (http://gritslab.gatech.edu)